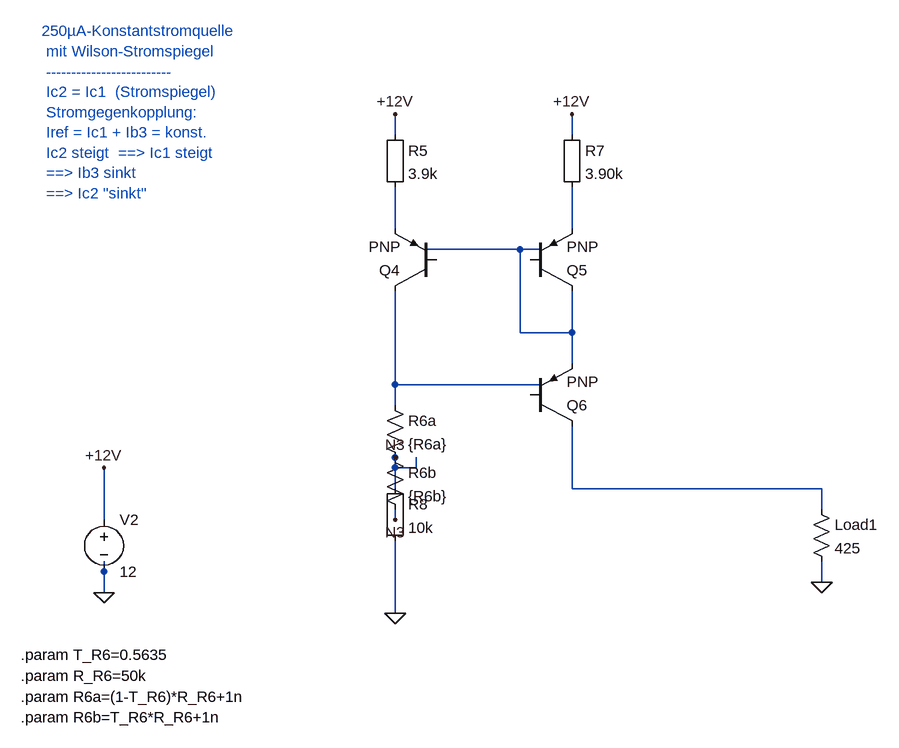
[diagram p0: schematic Konstantstromquelle.asc]
Konstantstromquelle.asc, the LTspice schematic file:
Version 4
SHEET 1 880 680
WIRE 704 432 688 432
WIRE 688 432 688 416
WIRE 640 384 640 352
WIRE 848 432 864 432
WIRE 864 432 864 416
WIRE 912 384 912 352
WIRE 848 640 864 640
WIRE 864 640 864 624
WIRE 912 592 912 560
WIRE 192 912 192 896
WIRE 912 480 912 544
WIRE 912 544 912 560
WIRE 864 416 832 416
WIRE 192 752 192 832
WIRE 192 896 192 944
WIRE 640 208 640 240
WIRE 640 736 640 752
WIRE 640 656 640 624
WIRE 640 624 640 480
WIRE 864 624 640 624
WIRE 912 208 912 240
WIRE 1296 928 1296 896
WIRE 1296 816 1296 784
WIRE 1296 784 912 784
WIRE 912 784 912 688
WIRE 832 416 832 544
WIRE 832 544 912 544
WIRE 688 416 832 416
WIRE 672 736 672 752
WIRE 672 752 640 752
WIRE 640 752 640 784
WIRE 640 864 640 976
WIRE 640 320 640 352
WIRE 912 352 912 320
WIRE 640 816 640 832
FLAG 192 944 0
FLAG 640 976 0
FLAG 1296 928 0
FLAG 192 944 0
FLAG 640 976 0
FLAG 1296 928 0
FLAG 640 832 N3
FLAG 640 736 N3
FLAG 192 752 +12V
FLAG 640 208 +12V
FLAG 912 208 +12V
SYMBOL pnp 704 480 R180
SYMATTR InstName Q4
SYMATTR Value PNP
SYMBOL pnp 848 480 M180
SYMATTR InstName Q5
SYMATTR Value PNP
SYMBOL pnp 848 688 M180
SYMATTR InstName Q6
SYMATTR Value PNP
SYMBOL Misc\EuropeanResistor 624 224 R0
SYMATTR InstName R5
SYMATTR Value 3.9k
SYMBOL voltage 192 816 R0
SYMATTR InstName V2
SYMATTR Value 12
SYMBOL res 624 640 R0
SYMATTR InstName R6a
SYMATTR Value {R6a}
SYMBOL res 624 720 R0
SYMATTR InstName R6b
SYMATTR Value {R6b}
SYMBOL Misc\EuropeanResistor 896 224 R0
SYMATTR InstName R7
SYMATTR Value 3.90k
SYMBOL res 1280 800 R0
SYMATTR InstName Load1
SYMATTR Value 425
SYMBOL Misc\EuropeanResistor 624 768 R0
SYMATTR InstName R8
SYMATTR Value 10k
TEXT 64 1040 Left 2 !.param T_R6=0.5635
TEXT 64 1072 Left 2 !.param R_R6=50k
TEXT 64 1104 Left 2 !.param R6a=(1-T_R6)*R_R6+1n
TEXT 64 1136 Left 2 !.param R6b=T_R6*R_R6+1n
TEXT 96 80 Left 2 ;250µA-Konstantstromquelle \n mit Wilson-Stromspiegel \n ------------------------- \n Ic2 = Ic1  (Stromspiegel) \n Stromgegenkopplung: \n Iref = Ic1 + Ib3 = konst. \n Ic2 steigt  ==> Ic1 steigt \n ==> Ib3 sinkt \n ==> Ic2 "sinkt"

The netlist it stands for:
* Konstantstromquelle.asc
Q4 N004 N001 N002 0 PNP
Q5 N001 N001 N003 0 PNP
Q6 N005 N004 N001 0 PNP
R5 +12V N002 3.9k
V2 +12V 0 12
R6a N004 N3 {R6a}
R6b N3 N3 {R6b}
R7 +12V N003 3.90k
R§Load1 N005 0 425
R8 N3 0 10k
.model NPN NPN
.model PNP PNP
.lib standard.bjt
.param T_R6=0.5635
.param R_R6=50k
.param R6a=(1-T_R6)*R_R6+1n
.param R6b=T_R6*R_R6+1n
* 250µA-Konstantstromquelle
*  mit Wilson-Stromspiegel
*  -------------------------
*  Ic2 = Ic1  (Stromspiegel)
*  Stromgegenkopplung:
*  Iref = Ic1 + Ib3 = konst.
*  Ic2 steigt  ==> Ic1 steigt
*  ==> Ib3 sinkt
*  ==> Ic2 "sinkt"
.backanno
.end